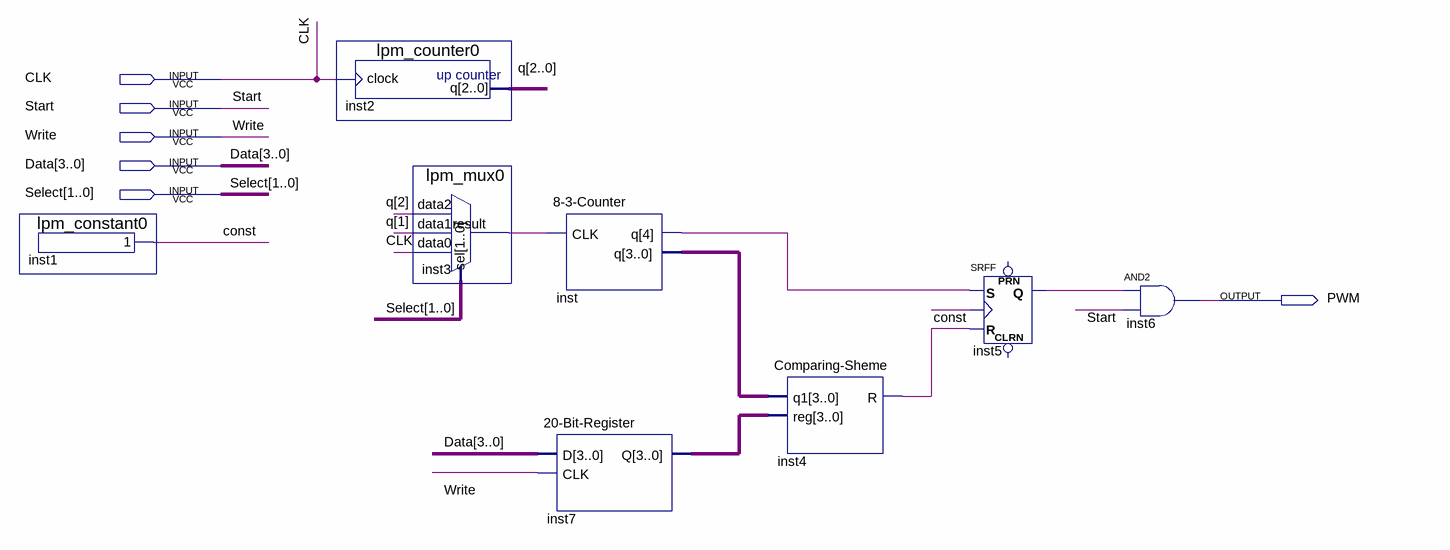
[diagram p0: schematic sheet]
// Quartus schematic Converter-20-Bit-Parallel-Code-To-PWM.bdf as structural Verilog: 8 symbols, 6 pins
module \Converter-20-Bit-Parallel-Code-To-PWM  (
  input  CLK,
  input  Start,
  input  Write,
  input  [3:0] Data,
  input  [1:0] Select,
  output PWM
);

  wire \const , inst3_result, inst4_r, inst5_q, inst_q_2;
  wire [2:0] q;
  wire [3:0] inst7_q, inst_q;

  lpm_constant0 inst1 (.result(\const ));
  lpm_counter0 inst2 (.clock(CLK), .q(q));
  lpm_mux0 inst3 (.data2(q[2]), .data1(q[1]), .data0(CLK), .sel(Select), .result(inst3_result));
  \8-3-Counter  inst (.CLK(inst3_result), .q({inst_q_2, inst_q}));
  \20-Bit-Register  inst7 (.D(Data), .CLK(Write), .Q(inst7_q));
  \Comparing-Sheme  inst4 (.q1(inst_q), .\reg (inst7_q), .R(inst4_r));
  SRFF inst5 (.S(inst_q_2), .R(inst4_r), .CLK(\const ), .Q(inst5_q));  // open: PRN, CLRN
  and inst6 (PWM, inst5_q, Start);
endmodule
